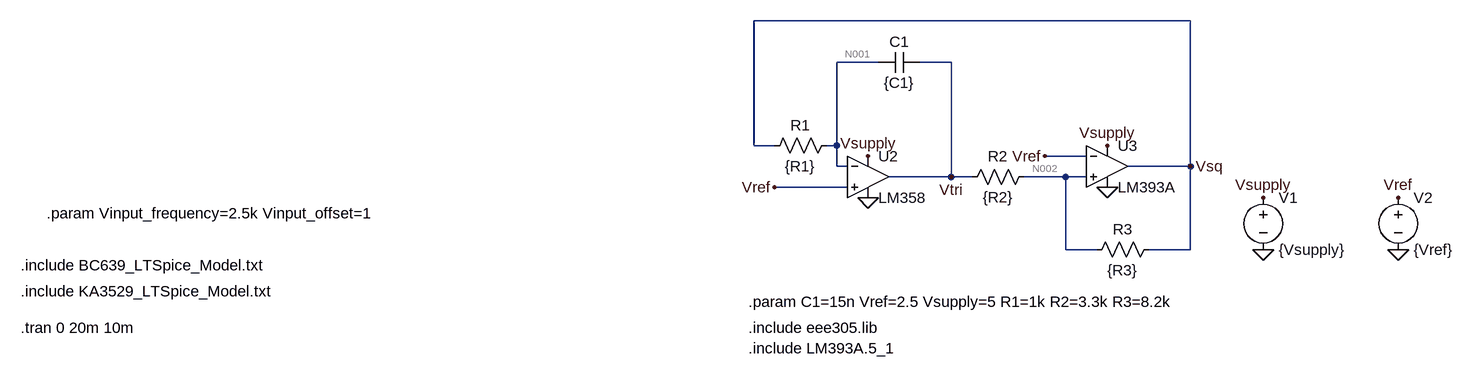
[diagram p0: schematic Assignment1_Task2_2_Practical no pullup.asc]
Assignment1_Task2_2_Practical no pullup.asc, the LTspice schematic file:
Version 4
SHEET 1 4884 1384
WIRE 352 -224 -320 -224
WIRE -128 -160 -192 -160
WIRE -16 -160 -64 -160
WIRE -320 -32 -320 -224
WIRE -288 -32 -320 -32
WIRE -192 -32 -192 -160
WIRE -192 -32 -208 -32
WIRE 192 -16 128 -16
WIRE -192 0 -192 -32
WIRE -176 0 -192 0
WIRE 352 0 352 -224
WIRE 352 0 256 0
WIRE -16 16 -16 -160
WIRE -16 16 -112 16
WIRE 16 16 -16 16
WIRE 160 16 96 16
WIRE 192 16 160 16
WIRE -176 32 -288 32
WIRE 160 128 160 16
WIRE 208 128 160 128
WIRE 352 128 352 0
WIRE 352 128 288 128
FLAG 464 128 0
FLAG 464 48 Vsupply
FLAG -16 16 Vtri
FLAG 224 32 0
FLAG -144 48 0
FLAG -288 32 Vref
FLAG 128 -16 Vref
FLAG 352 0 Vsq
FLAG -144 -16 Vsupply
FLAG 224 -32 Vsupply
FLAG 672 48 Vref
FLAG 672 128 0
SYMBOL voltage 464 32 R0
WINDOW 123 0 0 Left 0
WINDOW 39 0 0 Left 0
SYMATTR InstName V1
SYMATTR Value {Vsupply}
SYMBOL res -192 -48 R90
WINDOW 0 0 56 VBottom 2
WINDOW 3 32 56 VTop 2
SYMATTR InstName R1
SYMATTR Value {R1}
SYMBOL cap -64 -176 R90
WINDOW 0 0 32 VBottom 2
WINDOW 3 32 32 VTop 2
SYMATTR InstName C1
SYMATTR Value {C1}
SYMATTR SpiceLine Rser=10m
SYMBOL res 112 0 R90
WINDOW 0 0 56 VBottom 2
WINDOW 3 32 56 VTop 2
SYMATTR InstName R2
SYMATTR Value {R2}
SYMBOL res 304 112 R90
WINDOW 0 0 56 VBottom 2
WINDOW 3 32 56 VTop 2
SYMATTR InstName R3
SYMATTR Value {R3}
SYMBOL voltage 672 32 R0
WINDOW 123 0 0 Left 0
WINDOW 39 0 0 Left 0
SYMATTR InstName V2
SYMATTR Value {Vref}
SYMBOL OpAmps\\opamp2 -144 -48 R0
SYMATTR InstName U2
SYMATTR Value LM358
SYMBOL OpAmps\\opamp2 224 -64 R0
SYMATTR InstName U3
SYMATTR Value LM393A
TEXT -328 208 Left 2 !.param C1=15n Vref=2.5 Vsupply=5 R1=1k R2=3.3k R3=8.2k
TEXT -328 280 Left 2 !.include LM393A.5_1
TEXT -1408 72 Left 2 !.param Vinput_frequency=2.5k Vinput_offset=1
TEXT -1448 152 Left 2 !.include BC639_LTSpice_Model.txt
TEXT -1448 192 Left 2 !.include KA3529_LTSpice_Model.txt
TEXT -1448 248 Left 2 !.tran 0 20m 10m
TEXT -328 248 Left 2 !.include eee305.lib

The netlist it stands for:
* Assignment1_Task2_2_Practical no pullup.asc
V1 Vsupply 0 {Vsupply}
R1 N001 Vsq {R1}
C1 Vtri N001 {C1} Rser=10m
R2 N002 Vtri {R2}
R3 Vsq N002 {R3}
V2 Vref 0 {Vref}
XU2 Vref N001 Vsupply 0 Vtri LM358  ; pins In+ In- V+ V- OUT
XU3 N002 Vref Vsupply 0 Vsq LM393A  ; pins In+ In- V+ V- OUT
.param C1=15n Vref=2.5 Vsupply=5 R1=1k R2=3.3k R3=8.2k
.include LM393A.5_1
.param Vinput_frequency=2.5k Vinput_offset=1
.include BC639_LTSpice_Model.txt
.include KA3529_LTSpice_Model.txt
.tran 0 20m 10m
.include eee305.lib
.backanno
.end

* Results of the author's LTspice run, read from the files saved beside the schematic
* Operating Point, zero values left out:
*   V(vsupply) = 5 V
*   V(n001) = 2.5 V
*   V(vsq) = 2.5 V
*   V(vtri) = 2.5 V
*   V(n002) = 2.5 V
*   V(vref) = 2.5 V
*   I(R3) = -35.26 nA
*   I(R2) = -10.3 nA
*   I(R1) = 44.96 nA
*   I(V2) = 69.75 nA
*   I(V1) = -774.1 µA
*   Ix(u2:1) = -44.74 nA
*   Ix(u2:2) = -44.96 nA
*   Ix(u2:3) = 566.1 µA
*   Ix(u2:4) = -565.5 µA
*   Ix(u2:5) = -10.3 nA
*   Ix(u3:1) = -24.96 nA
*   Ix(u3:2) = -25.01 nA
*   Ix(u3:3) = 208 µA
*   Ix(u3:4) = -208 µA
*   Ix(u3:5) = 80.22 nA
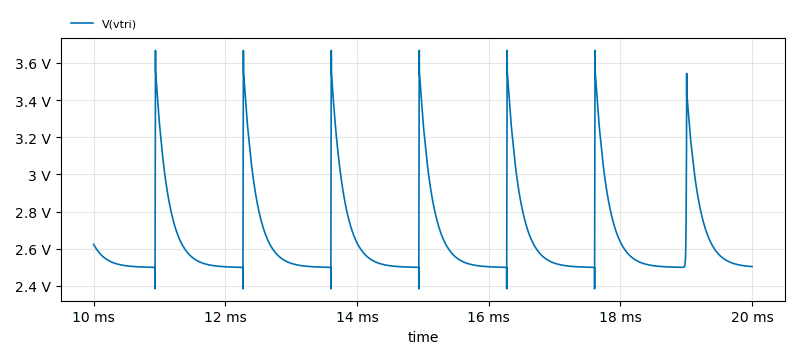
[diagram p1: Transient Analysis of Assignment1_Task2_2_Practical no pullup.asc, plotted from the saved traces]
* Transient Analysis, 1 run:
*   V(vtri): min 2.384 V, max 3.668 V, average 2.642 V, rms 2.653 V, last 2.504 V